# EAGLE design digitalclock (EAGLE 9.6.2)
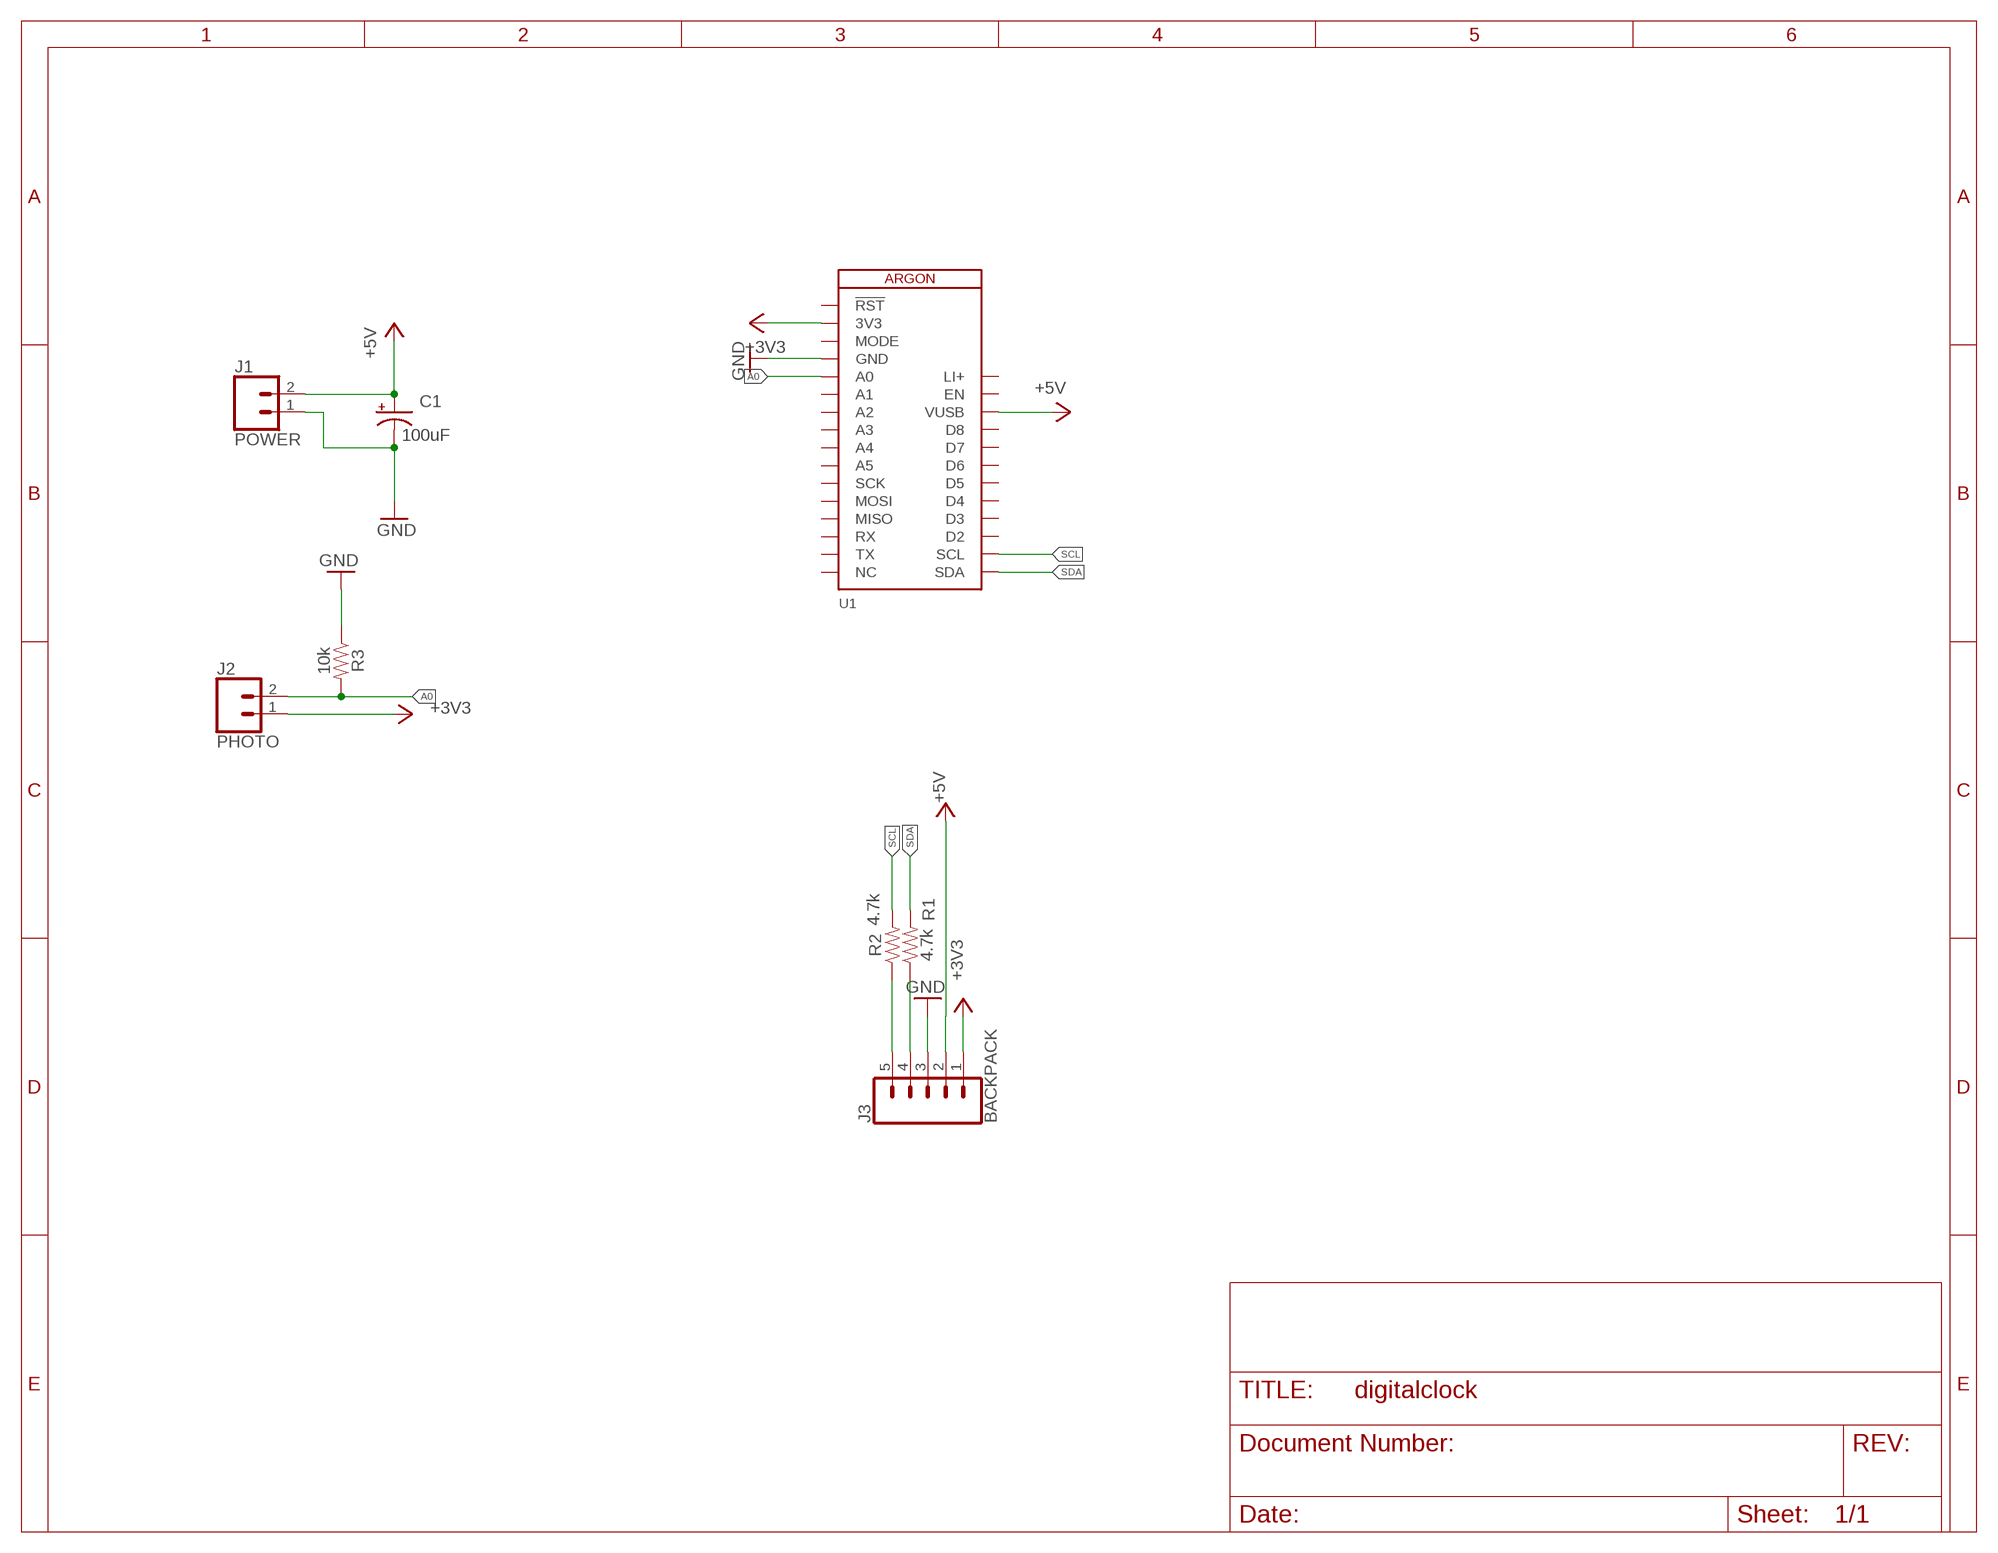
[diagram p0: schematic, sheet 1]

## Parts
C1  100uF  100UF-POLAR-RADIAL-2.5MM-25V-20%  [CPOL-RADIAL-2.5MM-6.5MM]
J1  POWER  CONN_02  [1X02]
J2  PHOTO  CONN_02  [1X02]
J3  BACKPACK  CONN_05  [1X05]
R1  4.7k  1KOHM-HORIZ-1/4W-5%  [AXIAL-0.3]
R2  4.7k  1KOHM-HORIZ-1/4W-5%  [AXIAL-0.3]
R3  10k  1KOHM-HORIZ-1/4W-5%  [AXIAL-0.3]
U1  ARGON  [ARGON]

## Nets
+3V3: J2.1 J3.1 U1.2(3V3)
+5V: C1.1(+) J1.2 J3.2 U1.26(VUSB)
A0: J2.2 R3.P$2 U1.5(A0)
GND: C1.2(-) J1.1 J3.3 R3.P$1 U1.4(GND)
N$1: J3.5 R2.P$1
N$2: J3.4 R1.P$1
SCL: R2.P$2 U1.18(SCL)
SDA: R1.P$2 U1.17(SDA)
Unconnected: U1.1(!RST) U1.3(MODE) U1.6(A1) U1.7(A2) U1.8(A3) U1.9(A4) U1.10(A5) U1.11(SCK) U1.12(MOSI) U1.13(MISO) U1.14(RX) U1.15(TX) U1.16(NC) U1.19(D2) U1.20(D3) U1.21(D4) U1.22(D5) U1.23(D6) U1.24(D7) U1.25(D8) U1.27(EN)

## Power pins joined to a net without a drawn wire
LI+: U1.28(LI+)

## Library data of the parts
C1 = SparkFun-Capacitors:100UF-POLAR: 100µF polarized capacitors A capacitor is a passive two-terminal electrical component used to store electrical energy temporarily in an electric field.; PROD_ID: CAP-08439
J1 J2 = SparkFun-Connectors:CONN_02: Multi connection point. Often used as Generic Header-pin footprint for 0.1 inch spaced/style header connections On any of the 0.1 inch spaced packages, you can populate with these: Break Away Headers - Straight <https://www.sparkfun.com/products/116> (PRT-00116) Break Away Male Headers - Right Angle <https://www.sparkfun.com/products/553> (PRT-00553) Female Headers <https://www.sparkfun.com/products/115> (PRT-00115) Break Away Headers - Machine Pin <https://www.sparkfun.com/products/117> (PRT-00117) Break Away Female Headers - Swiss Machine Pin <https://www.sparkfun.com/products/743> (PRT-00743) For SCREWTERMINALS and SPRING TERMINALS visit here: Screw Terimnals on SparkFun.com <https://www.sparkfun.com/search/results?term=Screw+Terminals> (5mm/3.5mm/2.54mm spacing) This device is also useful as a general connection point to wire up your design to another part of your project. Our various solder wires solder well into these plated through hole pads. Hook-Up Wire - Assortment (Stranded, 22 AWG) <https://www.sparkfun.com/products/11375> (PRT-11375) Hook-Up Wire - Assortment (Solid Core, 22 AWG) <https://www.sparkfun.com/products/11367> (PRT-11367) View the entire wire category on our website here <https://www.sparkfun.com/categories/141> Special notes: Molex polarized connector foot print use with: PRT-08233 with associated crimp pins and housings. 2.54_SCREWTERM for use with PRT-10571. 3.5mm Screw Terminal footprints for PRT-08084 5mm Screw Terminal footprints for use with PRT-08432
J3 = SparkFun-Connectors:CONN_05: Multi connection point. Often used as Generic Header-pin footprint for 0.1 inch spaced/style header connections On any of the 0.1 inch spaced packages, you can populate with these: Break Away Headers - Straight <https://www.sparkfun.com/products/116> (PRT-00116) Break Away Male Headers - Right Angle <https://www.sparkfun.com/products/553> (PRT-00553) Female Headers <https://www.sparkfun.com/products/115> (PRT-00115) Break Away Headers - Machine Pin <https://www.sparkfun.com/products/117> (PRT-00117) Break Away Female Headers - Swiss Machine Pin <https://www.sparkfun.com/products/743> (PRT-00743) For SCREWTERMINALS and SPRING TERMINALS visit here: Screw Terimnals on SparkFun.com <https://www.sparkfun.com/search/results?term=Screw+Terminals> (5mm/3.5mm/2.54mm spacing) This device is also useful as a general connection point to wire up your design to another part of your project. Our various solder wires solder well into these plated through hole pads. Hook-Up Wire - Assortment (Stranded, 22 AWG) <https://www.sparkfun.com/products/11375> (PRT-11375) Hook-Up Wire - Assortment (Solid Core, 22 AWG) <https://www.sparkfun.com/products/11367> (PRT-11367) View the entire wire category on our website here <https://www.sparkfun.com/categories/141> Special notes: Molex polarized connector foot print use with SKU : PRT-08231 with associated crimp pins and housings. 1MM SMD Version SKU: PRT-10208
R1-R3 = SparkFun-Resistors:1KOHM: 1kΩ resistor A resistor is a passive two-terminal electrical component that implements electrical resistance as a circuit element. Resistors act to reduce current flow, and, at the same time, act to lower voltage levels within circuits. - Wikipedia; PROD_ID: RES-08380; VALUE: 1k
U1 = Particle-Devices:ARGON: ARGON The Particle Argon is a powerful Wi-Fi development kit that you can use as a standalone Wi-Fi device or Wi-Fi enabled gateway, repeater, or endpoint for Particle Mesh networks. More information: https://docs.particle.io/argon/ Footprint and formfactor based on Adafruit Feather. <https://www.adafruit.com/feather>

## Board
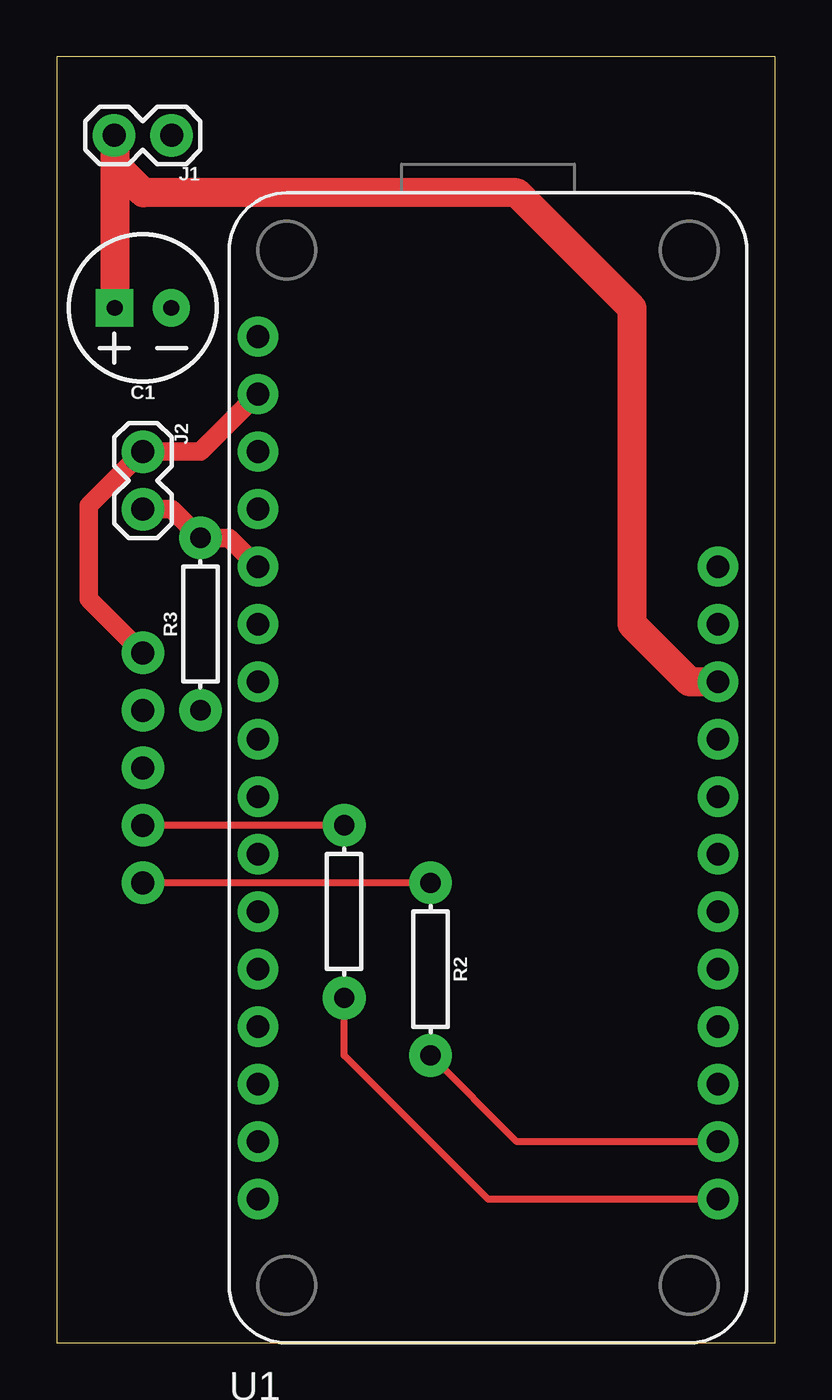
[diagram p1: board, top side]
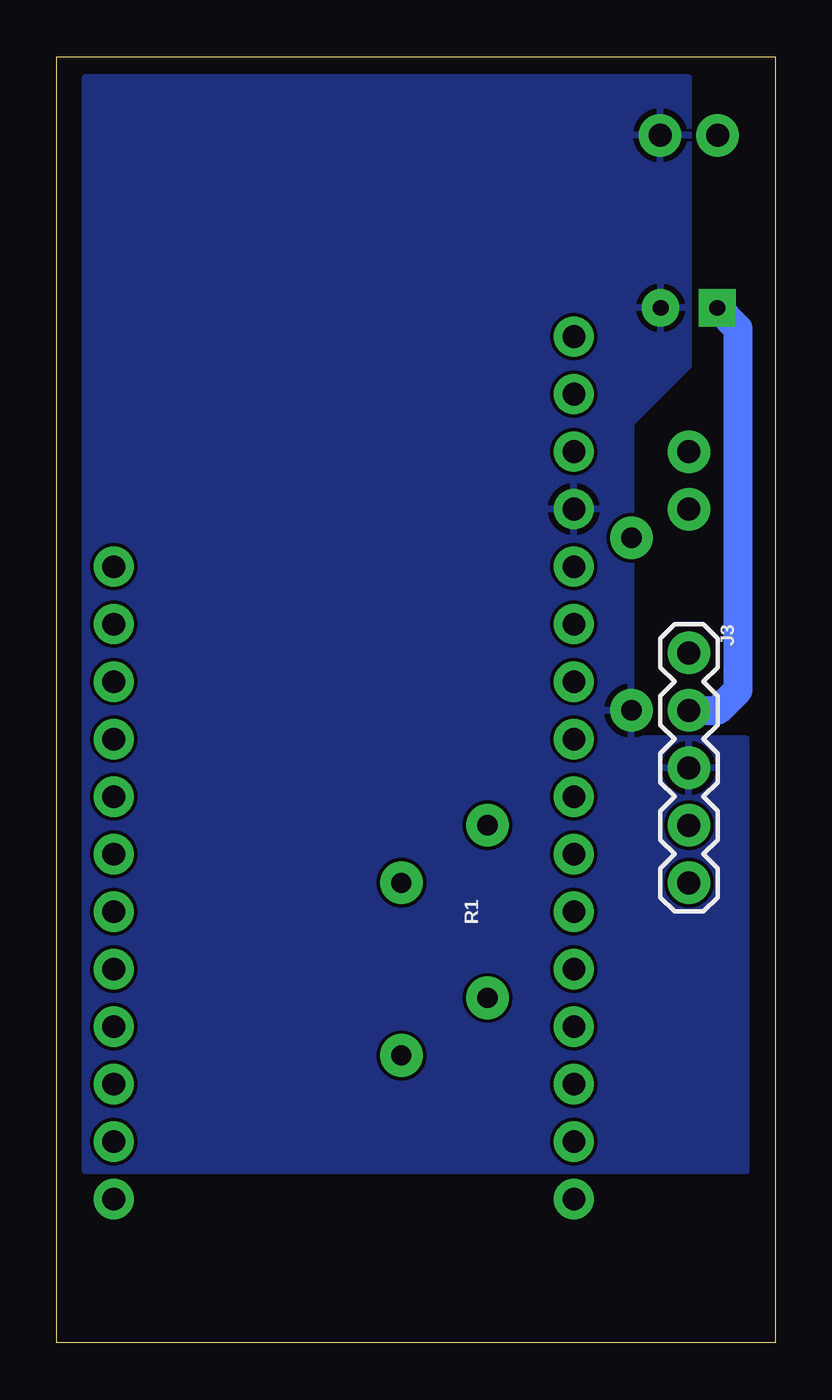
[diagram p2: board, bottom side, seen from below]

Size 31.73 x 56.82 mm. Coordinates in mm from the lower left corner, seen from the top.
Outline: 0,0 31.73,0 31.73,56.82 0,56.82 0,0
Copper layers (1*16): Top 0.035559375mm / dielectric 1.6mm / Bottom 0.035559375mm
Design rules "oshpark-2layer": minimum track width 6mil, minimum drill 10mil, track to track 6mil, track to pad 6mil, pad to pad 6mil, via to via 6mil, smd to smd 6mil, copper to edge 15mil, drill to drill 6mil, minimum pad ring 5mil, minimum via ring 5mil, stop-mask expansion 2.5mil, vias tented up to drill 0mil, thermal gap 10mil

### Footprints (pad centres in the part's own frame; a part is rotated, then mirrored left to right if it is on the bottom)
CPOL-RADIAL-2.5MM-6.5MM = drill 0.7 pad 1.651 square: 1 1.25,0 | drill 0.7 pad 1.651: 2 -1.25,0
1X02 = drill 1.016 pad 1.88: 1 0,0; 2 2.54,0
1X05 = drill 1.016 pad 1.88: 1 0,0; 2 2.54,0; 3 5.08,0; 4 7.62,0; 5 10.16,0
AXIAL-0.3 = drill 0.9 pad 1.88: P$1 -3.81,0; P$2 3.81,0
ARGON = drill 1 pad 1.778: 1 1.27,44.45; 2 1.27,41.91; 3 1.27,39.37; 4 1.27,36.83; 5 1.27,34.29; 6 1.27,31.75; 7 1.27,29.21; 8 1.27,26.67; 9 1.27,24.13; 10 1.27,21.59; 11 1.27,19.05; 12 1.27,16.51; 13 1.27,13.97; 14 1.27,11.43; 15 1.27,8.89; 16 1.27,6.35; 17 21.59,6.35; 18 21.59,8.89; 19 21.59,11.43; 20 21.59,13.97; 21 21.59,16.51; 22 21.59,19.05; 23 21.59,21.59; 24 21.59,24.13; 25 21.59,26.67; 26 21.59,29.21; 27 21.59,31.75; 28 21.59,34.29

### Placement (x,y rotation side)
C1  3.81,45.72 180 top
J1  5.08,53.34 180 top
J2  3.81,39.37 270 top
J3  3.81,30.48 270 bottom
R1  12.7,19.05 270 top
R2  16.51,16.51 270 top
R3  6.35,31.75 90 top
U1  7.62,0 0 top

### Tracks (layer width: path | path; a pad name or v marks a point on that pad's centre or on a via)
+3V3
  Top 0.813: U1.2 6.35,39.37 J2.1 1.42,36.98 1.42,32.87 J3.1
+5V
  Top 1.27: U1.26 27.94,29.21 25.4,31.75 25.4,45.72 20.32,50.8 3.83,50.8 2.56,52.07 | J1.2 2.56,53.34 2.56,52.07 | 2.56,52.07 C1.1
  Bottom 1.27: C1.1 1.65,44.81 1.65,28.83 2.54,27.94 J3.2
A0
  Top 0.813: J2.2 5.08,36.83 R3.P$2 7.62,35.56 U1.5
GND
  pour Bottom: 3.81,55.88 30.48,55.88 30.48,7.62 1.27,7.62 1.27,26.67 6.35,26.67 6.35,40.64 3.81,43.18
N$1
  Top 0.305: R2.P$1 J3.5
N$2
  Top 0.305: R1.P$1 J3.4
SCL
  Top 0.305: U1.18 20.32,8.89 R2.P$2
SDA
  Top 0.305: U1.17 19.05,6.35 12.7,12.7 R1.P$2